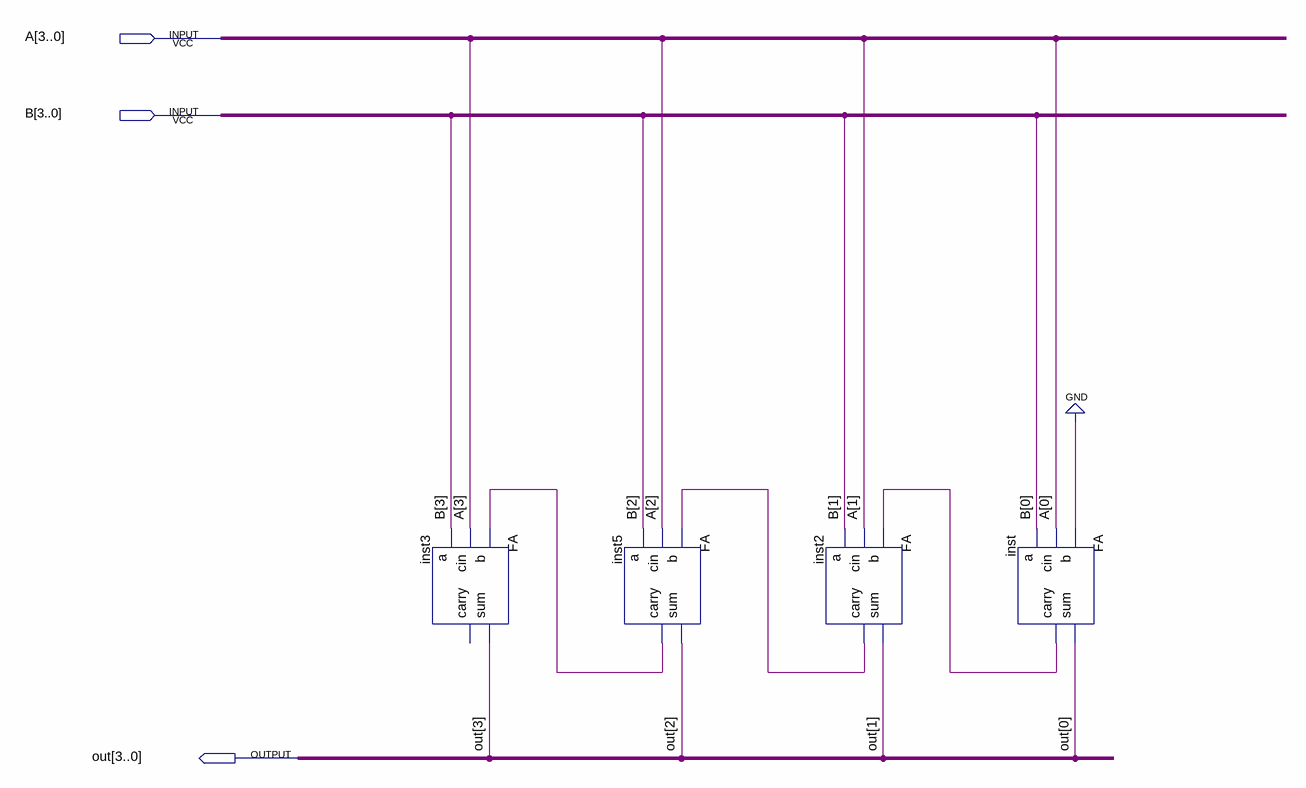
[diagram p0: schematic sheet]
// Quartus schematic 4bitAdder.bdf as structural Verilog: 4 symbols, 3 pins
module \4bitAdder  (
  input  [3:0] A,
  input  [3:0] B,
  output [3:0] out
);

  wire inst2_carry, inst5_carry, inst_carry;

  FA inst3 (.b(inst5_carry), .cin(A[3]), .a(B[3]), .sum(out[3]));  // open: carry
  FA inst5 (.b(inst2_carry), .cin(A[2]), .a(B[2]), .sum(out[2]), .carry(inst5_carry));
  FA inst2 (.b(inst_carry), .cin(A[1]), .a(B[1]), .sum(out[1]), .carry(inst2_carry));
  FA inst (.b(1'b0), .cin(A[0]), .a(B[0]), .sum(out[0]), .carry(inst_carry));

  // Other names for the same wires on the sheet: ai[3:0] = A; bi[3:0] = B
endmodule
